# Altium schematic sheet esp32Driver.SchDoc
size A3
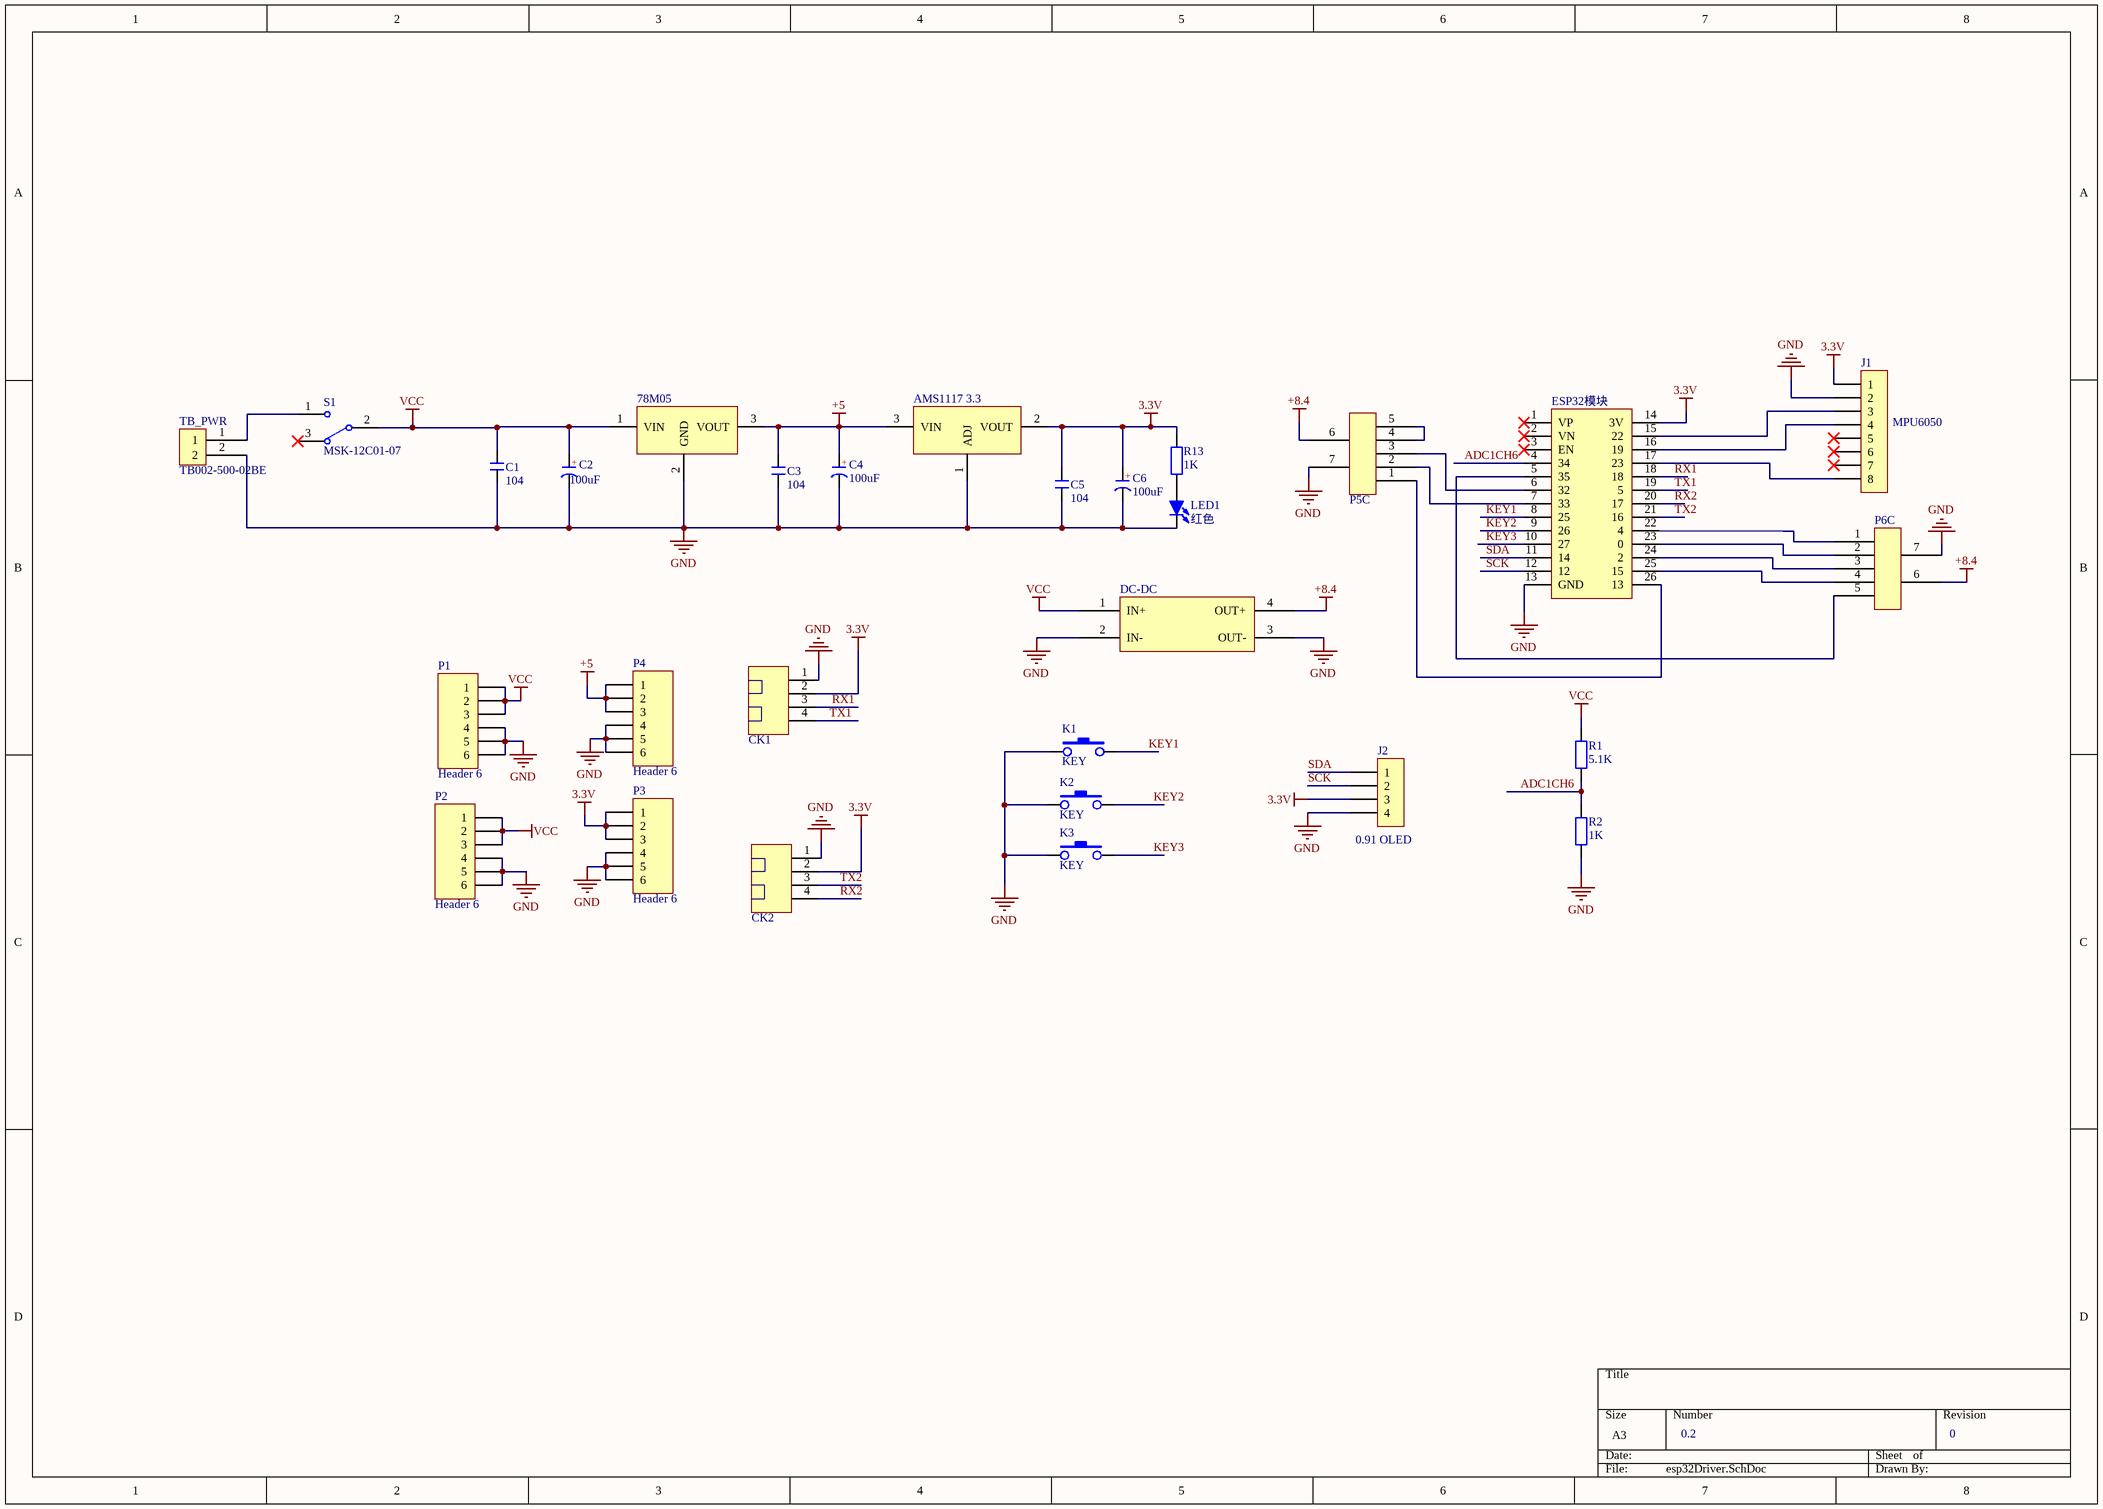
[diagram p0: esp32Driver.SchDoc]

## Parts
78M05  78M05  [TO252]  (value not drawn)
AMS1117_3.3  AMS1117 3.3  [SOT223]  (value not drawn)
C1  104  [R 0603_M]
C2  100uF  [C7343-D]
C3  104  [C 0603_M]
C4  100uF  [C7343-D]
C5  104  [C 0603_M]
C6  100uF  [C7343-D]
CK1  MX1.25-4P  [MX1.25WS-4P]  (value not drawn)
CK2  MX1.25-4P  [MX1.25WS-4P]  (value not drawn)
DC-DC  DC-DC  [DC-DC]  (value not drawn)
ESP32模块  ESP32  [esp32]  (value not drawn)
J1  MPU6050  [MPU6050]
J2  0.91 OLED  [HDR1X4- OLED]
K1  KEY  [SMD-3X6X2.5]
K2  KEY  [SMD-3X6X2.5]
K3  KEY  [SMD-3X6X2.5]
LED1  红色  [LED 0603R]
P1  Header 6  [HDR1X6]
P2  Header 6  [HDR1X6]
P3  Header 6  [HDR1X6]
P4  Header 6  [HDR1X6]
P5  3*5PIN  [HDR3X5]  (value not drawn)  (part C of 3)
P6  3*5PIN  [HDR3X5]  (value not drawn)  (part C of 3)
R1  5.1K  [R 0603_M]
R2  1K  [R 0603_M]
R13  1K  [R 0603_M]
S1  MSK-12C01-07  [MTS-my]
TB_PWR  TB002-500-02BE  [HT3.96W-2P]

## Nets
3.3V: AMS1117_3.3.2(VOUT) C5.2 C6.1(A) CK1.2 CK2.2 ESP32模块.14(3V) J1.1 J2.3 P3.1 P3.2 P3.3 R13.2
+5: 78M05.3(VOUT) AMS1117_3.3.3(VIN) C3.2 C4.1(A) P4.1 P4.2 P4.3
+8.4: DC-DC.4(OUT+) P5.6 P6.6
GND: 78M05.2(GND) AMS1117_3.3.1(ADJ) C1.1 C2.2(K) C3.1 C4.2(K) C5.1 C6.2(K) CK1.1 CK2.1 DC-DC.2(IN-) DC-DC.3(OUT-) ESP32模块.13(GND) J1.2 J2.4 K1.1 K2.1 K3.1 LED1.2(K) P1.4 P1.5 P1.6 P2.4 P2.5 P2.6 P3.4 P3.5 P3.6 P4.4 P4.5 P4.6 P5.7 P6.7 R2.1 TB_PWR.2
VCC: 78M05.1(VIN) C1.2 C2.1(A) DC-DC.1(IN+) P1.1 P1.2 P1.3 P2.1 P2.2 P2.3 R1.2 S1.2
ADC1CH6: ESP32模块.4(34) R1.1 R2.2
KEY1: ESP32模块.8(25) K1.3
KEY2: ESP32模块.9(26) K2.3
KEY3: ESP32模块.10(27) K3.3
RX1: CK1.3 ESP32模块.18
RX2: CK2.4 ESP32模块.20(17)
SCK: ESP32模块.12 J2.2
SDA: ESP32模块.11(14) J2.1
TX1: CK1.4 ESP32模块.19(5)
TX2: CK2.3 ESP32模块.21(16)
NetESP32模块_5: ESP32模块.5(35) P6.5
NetESP32模块_6: ESP32模块.6(32) P5.3
NetESP32模块_7: ESP32模块.7(33) P5.2
NetESP32模块_15: ESP32模块.15(22) J1.3
NetESP32模块_16: ESP32模块.16(19) J1.4
NetESP32模块_17: ESP32模块.17(23) J1.8
NetESP32模块_22: ESP32模块.22(4) P6.1
NetESP32模块_23: ESP32模块.23(0) P6.2
NetESP32模块_24: ESP32模块.24(2) P6.3
NetESP32模块_25: ESP32模块.25(15) P6.4
NetESP32模块_26: ESP32模块.26(13) P5.1
NetLED1_1: LED1.1(A) R13.1
NetP5_4: P5.4 P5.5
NetS1_1: S1.1 TB_PWR.1

Not connected (* = marked no-connect by the designer): ESP32模块 1(VP)* 2(VN)* 3(EN)*; J1 5* 6* 7*; S1 3*

## Notes on the sheet
- 0.2
- 0
- (in symbol C-CD) +
- (in symbol C-CT) +

## Library data of the parts
78M05 = 78Mxx: 线性稳压芯片; 版权归属: 源创客; BOM名称: 线性稳压芯片; 学习资源: www.ooocke.com
AMS1117_3.3 = LM317: 可调线性稳压芯片; 版权归属: 源创客; BOM名称: 可调线性稳压芯片; 学习资源: www.ooocke.com
C1 C3 C5 = C: 无极性贴片电容; 版权归属: 源创客; 材质: X7R; BOM名称: 无极性贴片电容; 学习资源: www.ooocke.com
C2 = C-CT: 贴片固态电容; 版权归属: 源创客; BOM名称: 贴片固态电容; 学习资源: www.ooocke.com
C4 C6 = C-CD: 贴片钽电容; 版权归属: 源创客; BOM名称: 贴片钽电容; 学习资源: www.ooocke.com
J1 = Pin HDR1X8
J2 = Pin HDR1X4
LED1 = LED-F234: 方形LED; 版权归属: 源创客; BOM名称: 方形LED; 学习资源: www.ooocke.com
P1-P4 = Header 6: Header, 6-Pin; LatestRevisionDate: 17-Jul-2002; LatestRevisionNote: Re-released for DXP Platform.; Publisher: Altium Limited
P5 P6 = Component_1
R1 R2 R13 = R: 贴片电阻; 版权归属: 源创客; BOM名称: 贴片电阻; 学习资源: www.ooocke.com
TB_PWR = TB002-500-02BE: Supplier 1: Mouser; Supplier Part Number 1: 490-TB002-500-02BE